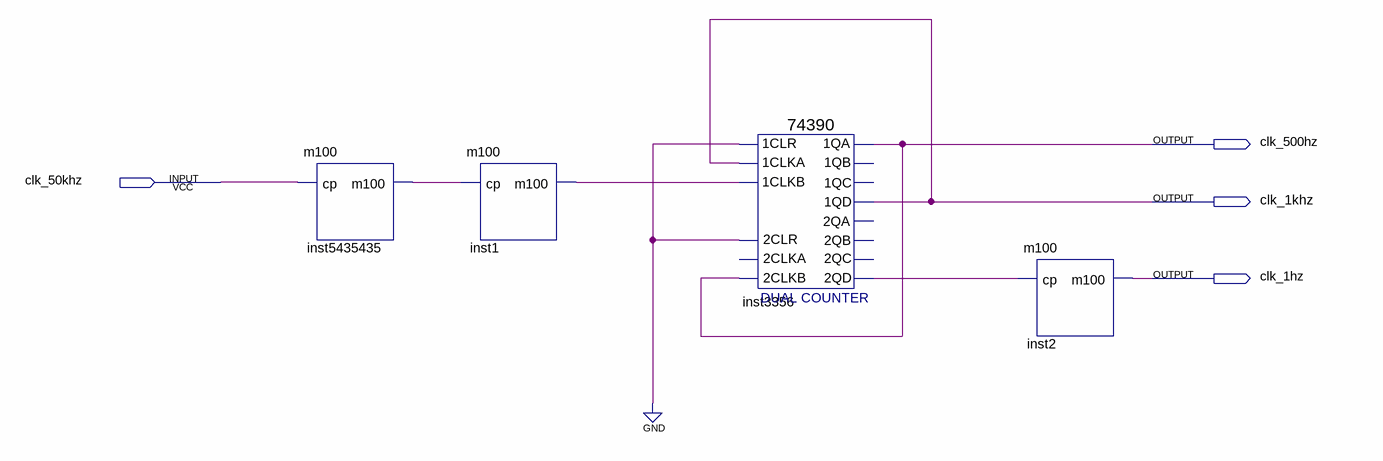
[diagram p0: schematic sheet]
// Quartus schematic sy02.bdf as structural Verilog: 4 symbols, 4 pins
module sy02 (
  input  clk_50khz,
  output clk_500hz,
  output clk_1khz,
  output clk_1hz
);

  wire inst1_m100, inst3356_2qd, inst5435435_m100;

  m100 inst5435435 (.cp(clk_50khz), .m100(inst5435435_m100));
  m100 inst1 (.cp(inst5435435_m100), .m100(inst1_m100));
  \74390  inst3356 (
    .\2CLR (1'b0), .\2CLKB (clk_500hz), .\1CLR (1'b0), .\1CLKA (clk_1khz), .\1CLKB (inst1_m100),
    .\1QA (clk_500hz), .\1QD (clk_1khz), .\2QD (inst3356_2qd));  // open: 2CLKA, 1QB, 1QC, 2QA, 2QB, 2QC
  m100 inst2 (.cp(inst3356_2qd), .m100(clk_1hz));
endmodule
